# EAGLE design Automaton320 (EAGLE 9.6.2)
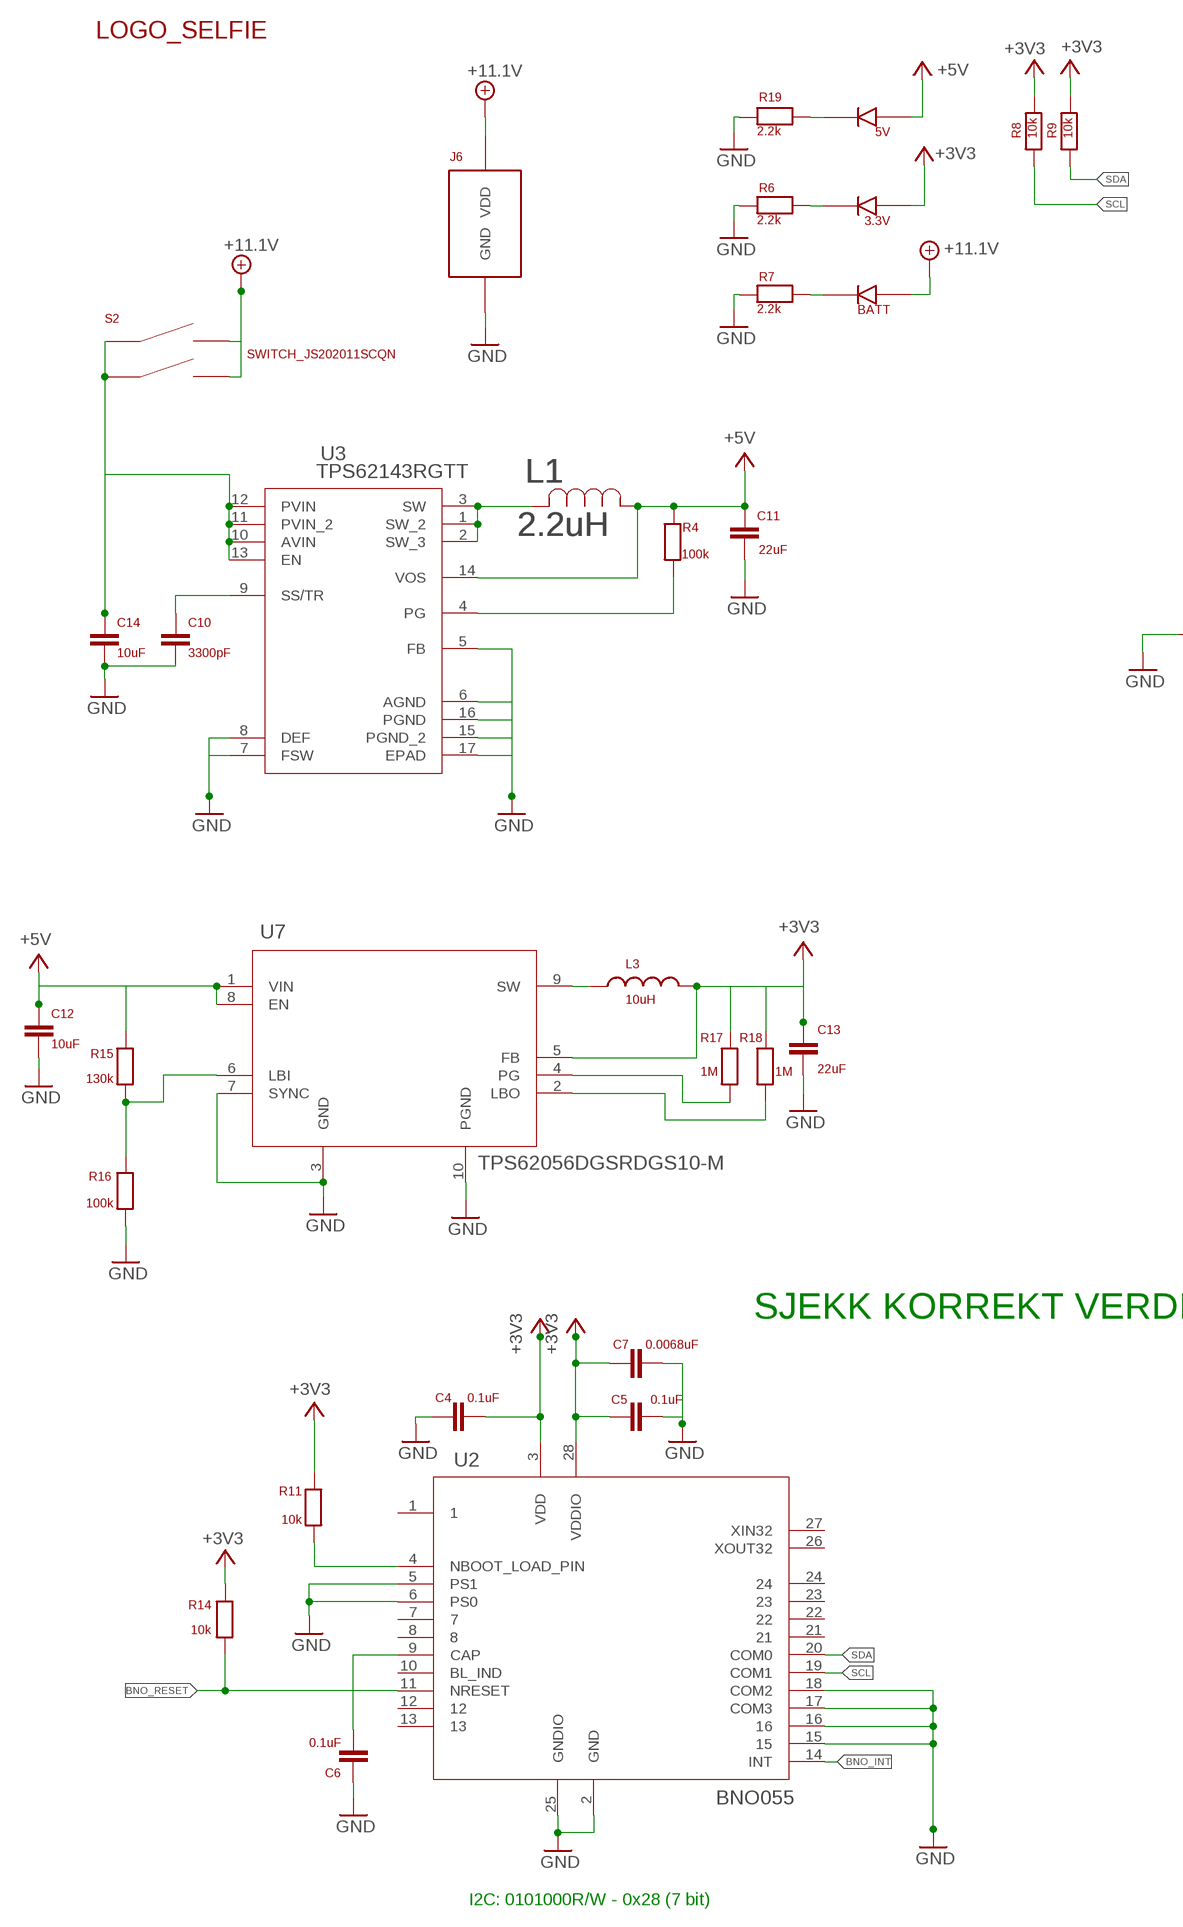
[diagram p0: schematic, sheet 1, part 1 of 2]
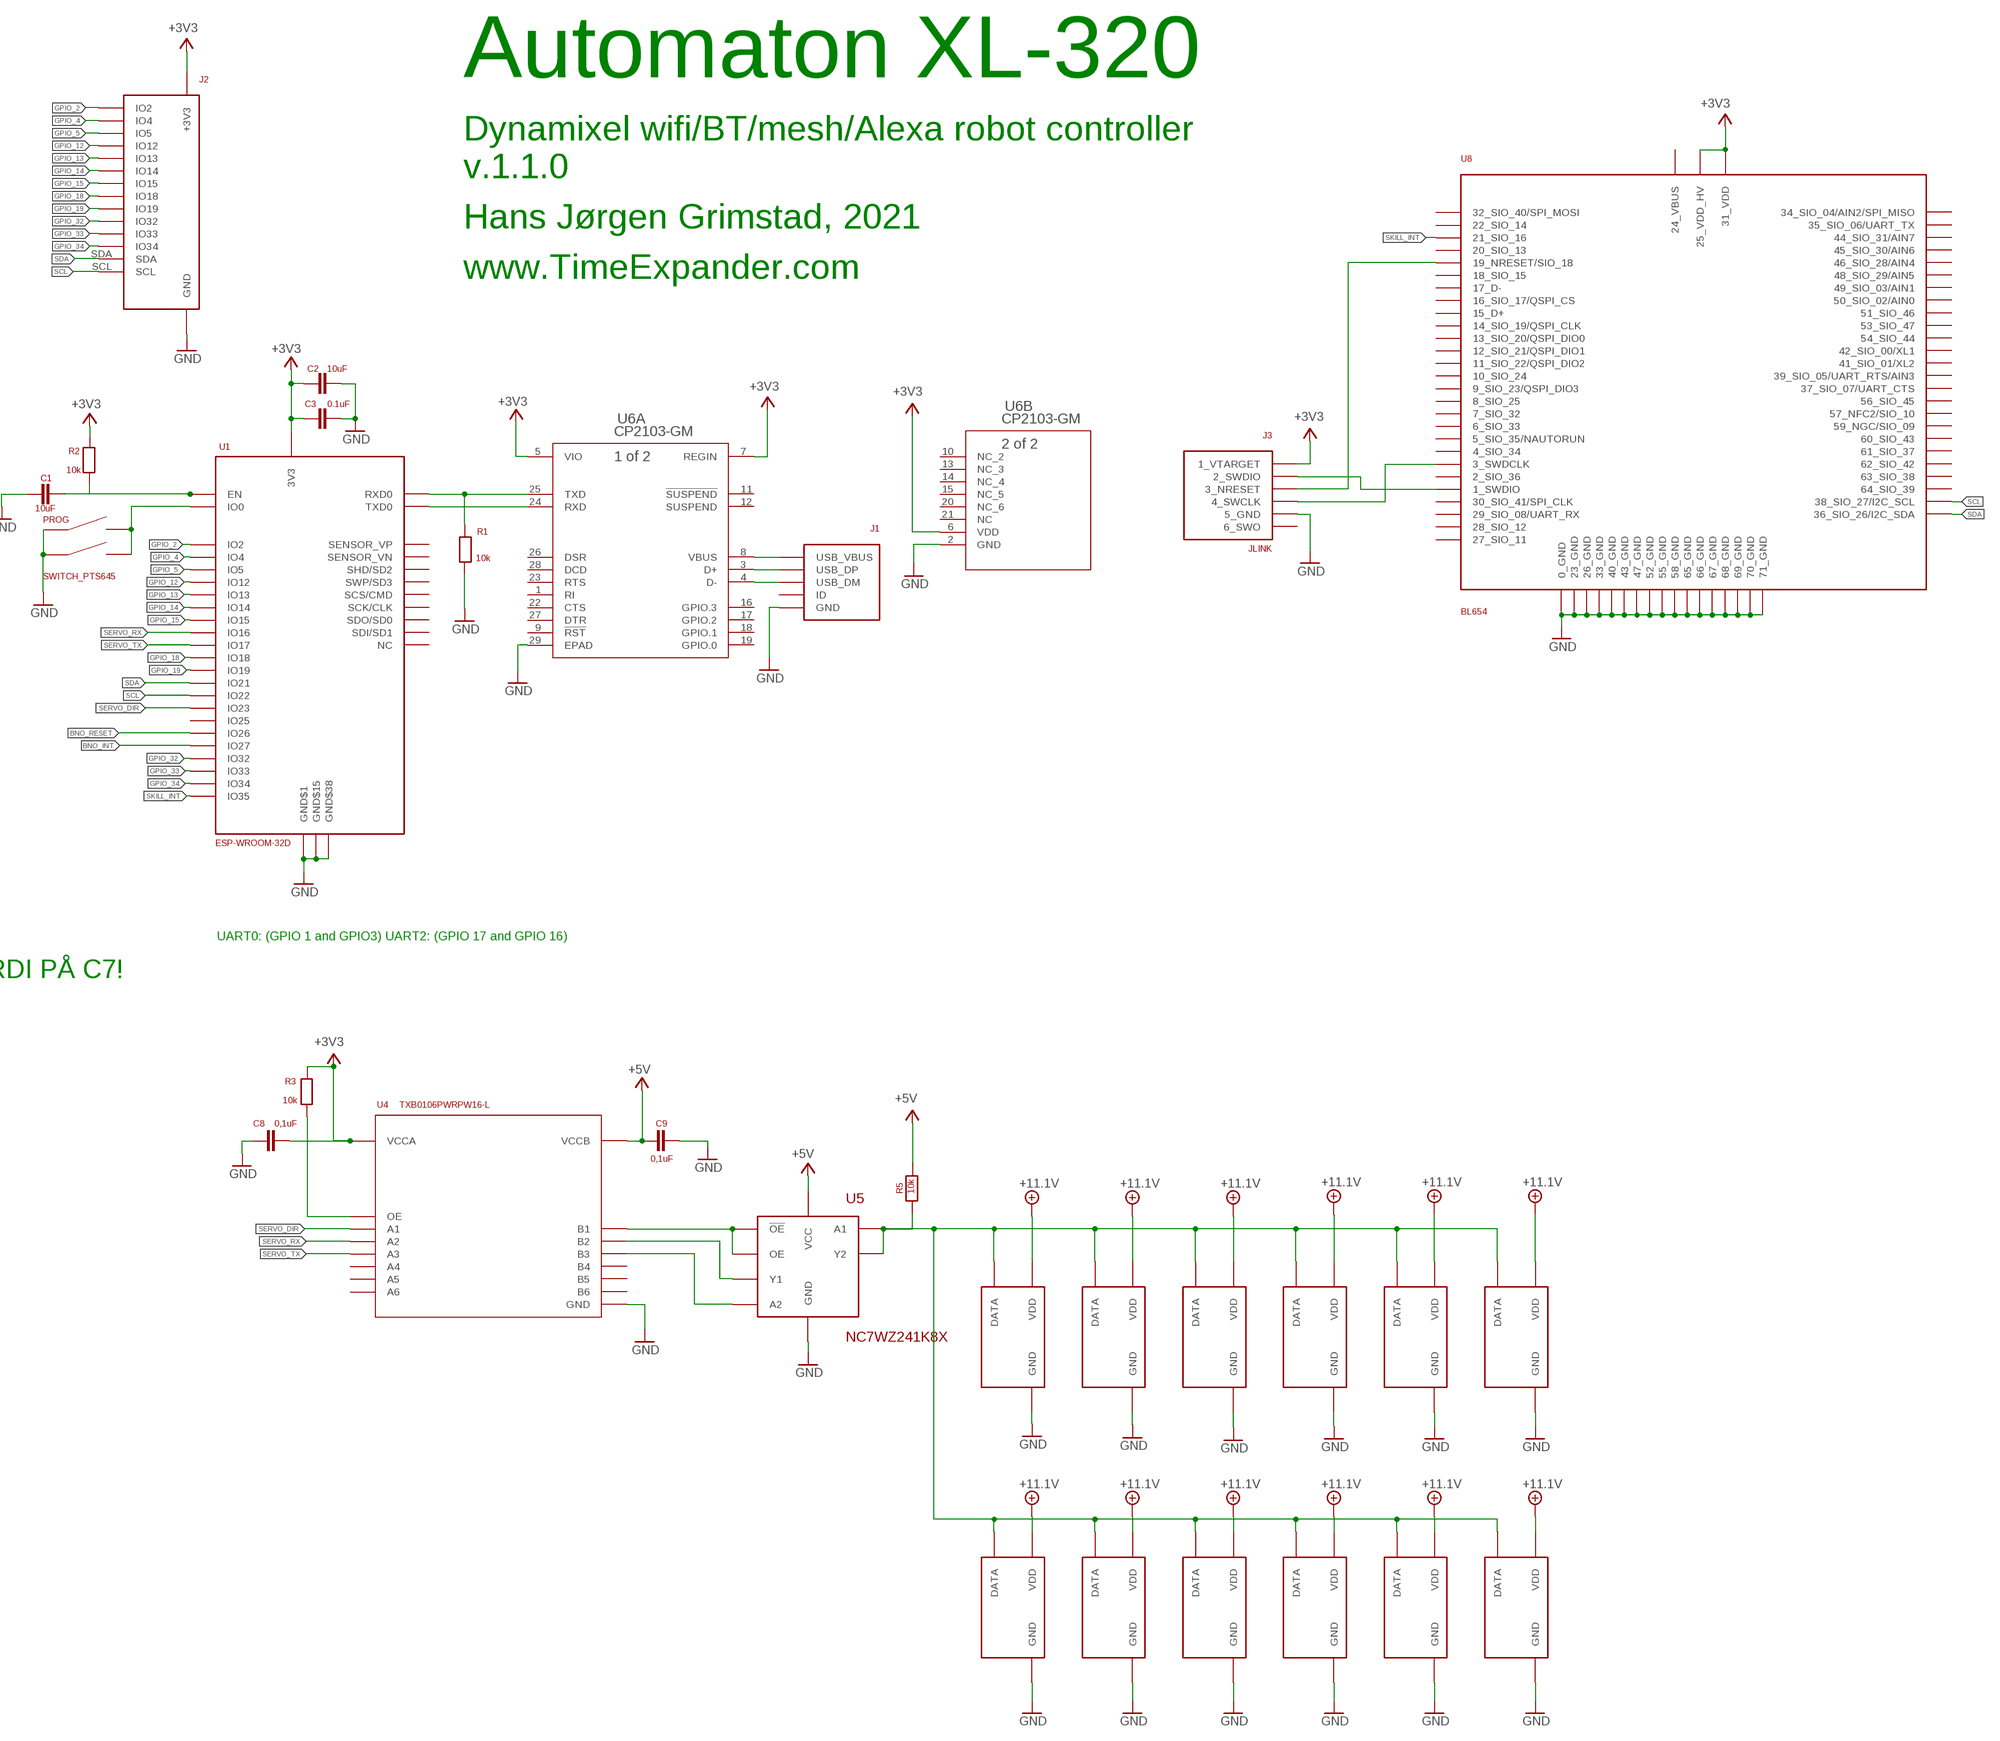
[diagram p1: schematic, sheet 1, part 2 of 2]

## Parts
3.3V  LED_APTR3216PBC/A  [LED_APTR3216PBC/A]
5V  LED_APTR3216PBC/A  [LED_APTR3216PBC/A]
BATT  LED_APTR3216PBC/A  [LED_APTR3216PBC/A]
C1  10uF  CAPACITOR0402  [CAP_0402]
C2  10uF  CAPACITOR0402  [CAP_0402]
C3  0.1uF  CAPACITOR0402  [CAP_0402]
C4  0.1uF  CAPACITOR0402  [CAP_0402]
C5  0.1uF  CAPACITOR0402  [CAP_0402]
C6  0.1uF  CAPACITOR0402  [CAP_0402]
C7  0.0068uF  CAPACITOR0402  [CAP_0402]
C8  0,1uF  CAPACITOR0402  [CAP_0402]
C9  0,1uF  CAPACITOR0402  [CAP_0402]
C10  3300pF  CAPACITOR0402  [CAP_0402]
C11  22uF  CAPACITOR1206  [CAP_1206]
C12  10uF  CAPACITOR1206  [CAP_1206]
C13  22uF  CAPACITOR1206  [CAP_1206]
C14  10uF  CAPACITOR1206  [CAP_1206]
DM1  DYNAMIXEL_MOLEX_MINISPOX_3P_HEADERAX-12  [DYNAMIXEL_MOLEX_MINISPOX_3P_HEADER]
DM2  DYNAMIXEL_MOLEX_MINISPOX_3P_HEADERAX-12  [DYNAMIXEL_MOLEX_MINISPOX_3P_HEADER]
DM3  DYNAMIXEL_MOLEX_MINISPOX_3P_HEADERAX-12  [DYNAMIXEL_MOLEX_MINISPOX_3P_HEADER]
DM4  DYNAMIXEL_MOLEX_MINISPOX_3P_HEADERAX-12  [DYNAMIXEL_MOLEX_MINISPOX_3P_HEADER]
DM5  DYNAMIXEL_MOLEX_MINISPOX_3P_HEADERAX-12  [DYNAMIXEL_MOLEX_MINISPOX_3P_HEADER]
DM6  DYNAMIXEL_MOLEX_MINISPOX_3P_HEADERAX-12  [DYNAMIXEL_MOLEX_MINISPOX_3P_HEADER]
J1  USB_RCPT_10118192-0001LF  [USB_RCPT_10118192-0001LF]
J2  ESP_ROBOT_BOARD_GPIO_16  [ESP_ROBOT_BOARD_GPIO_16]
J3  JLINK-6PIN  [JLINK-6PIN]
J6  BATTERY  POWER_SOLDER_TERMINAL9V  [BATTERY_SOLDER_TERMINAL]
L1  2.2uH  IHLP1616ABER2R2M11IND_IHLP-1616AB-M  [IND_IHLP-1616AB-M]
L3  10uH  INDUCTOR_VLCF4024T-100MR90-2  [IND_4028]
PROG  SWITCH_PTS645  [SWITCH_PTS645_EE_NBIOT_01]
R1  10k  RESISTOR  [RES_0402]
R2  10k  RESISTOR  [RES_0402]
R3  10k  RESISTOR  [RES_0402]
R4  100k  RESISTOR  [RES_0402]
R5  10k  RESISTOR  [RES_0402]
R6  2.2k  RESISTOR  [RES_0402]
R7  2.2k  RESISTOR  [RES_0402]
R8  10k  RESISTOR  [RES_0402]
R9  10k  RESISTOR  [RES_0402]
R11  10k  RESISTOR  [RES_0402]
R14  10k  RESISTOR  [RES_0402]
R15  130k  RESISTOR  [RES_0402]
R16  100k  RESISTOR  [RES_0402]
R17  1M  RESISTOR  [RES_0402]
R18  1M  RESISTOR  [RES_0402]
R19  2.2k  RESISTOR  [RES_0402]
S2  SWITCH_JS202011SCQN  [SWITCH_JS202011SCQN]
U1  ESP-WROOM-32D  [ESP_WROOM_32D]
U2  BNO055  [QFN_BNO055]
U3  TPS62143RGTT  [RGT16_1P7X1P7]
U4  TXB0106PWRPW16-L  [PW16-L]
U5  NC7WZ241K8X  [NC7WZ241K8X]
U6  CP2103-GM  CP2103-GMQFN28_5X5_SIL-M  [QFN28_5X5_SIL-M]
U7  TPS62056DGSRDGS10-M  [DGS10-M]
U8  BL654  [BL654]
U$1  DYNAMIXEL_MOLEX_MINISPOX_3P_HEADERXL-320  [DYNAMIXEL_MICROLATCH_3P_HEADER]
U$2  LOGO_SELFIESELFIE_2  [TIMEEXPANDER_LOGO_1]
U$4  DYNAMIXEL_MOLEX_MINISPOX_3P_HEADERXL-320  [DYNAMIXEL_MICROLATCH_3P_HEADER]
U$5  DYNAMIXEL_MOLEX_MINISPOX_3P_HEADERXL-320  [DYNAMIXEL_MICROLATCH_3P_HEADER]
U$6  DYNAMIXEL_MOLEX_MINISPOX_3P_HEADERXL-320  [DYNAMIXEL_MICROLATCH_3P_HEADER]
U$8  DYNAMIXEL_MOLEX_MINISPOX_3P_HEADERXL-320  [DYNAMIXEL_MICROLATCH_3P_HEADER]
U$9  DYNAMIXEL_MOLEX_MINISPOX_3P_HEADERXL-320  [DYNAMIXEL_MICROLATCH_3P_HEADER]

## Nets
+3V3: 3.3V.A C2.P$1 C3.P$1 C4.P$2 C5.P$1 C7.P$1 C8.P$2 C13.P$1 J2.+3V3 J3.1_VTARGET L3.2 R2.P$2 R3.P$2 R8.P$2 R9.P$2 R11.P$2 R14.P$2 R17.P$2 R18.P$2 U1.2(3V3) U2.3(VDD) U2.28(VDDIO) U4.2(VCCA) U6.5(A:VIO) U6.6(B:VDD) U6.7(A:REGIN) U7.5(FB) U8.25(25_VDD_HV) U8.31(31_VDD)
+5V: 5V.A C9.P$1 C11.P$1 C12.P$1 L1.1 R4.P$2 R5.P$2 R15.P$2 U3.14(VOS) U4.15(VCCB) U5.VCC U7.1(VIN) U7.8(EN)
+10V: BATT.A DM1.VDD DM2.VDD DM3.VDD DM4.VDD DM5.VDD DM6.VDD J6.+(VDD) S2.3(B2) S2.6(B1) U$1.VDD U$4.VDD U$5.VDD U$6.VDD U$8.VDD U$9.VDD ; supply symbol labelled +11.1V
BNO_INT: U1.12(IO27) U2.14(INT)
BNO_RESET: R14.P$1 U1.11(IO26) U2.11(NRESET)
GND: C1.P$1 C2.P$2 C3.P$2 C4.P$1 C5.P$2 C6.P$1 C7.P$2 C8.P$1 C9.P$2 C10.P$2 C11.P$2 C12.P$2 C13.P$2 C14.P$2 DM1.GND DM2.GND DM3.GND DM4.GND DM5.GND DM6.GND J1.GND J2.GND J3.5_GND J6.-(GND) PROG.A1 PROG.A2 R1.P$2 R6.P$1 R7.P$1 R16.P$1 R19.P$1 U1.1(GND$1) U1.15(GND$15) U1.38(GND$38) U1.GND$39(GND$38) U1.GND$40(GND$38) U1.GND$41(GND$38) U1.GND$42(GND$38) U1.GND$43(GND$38) U1.GND$44(GND$38) U1.GND$45(GND$38) U1.GND$46(GND$38) U1.GND$47(GND$38) U2.2(GND) U2.5(PS1) U2.6(PS0) U2.15 U2.16 U2.17(COM3) U2.18(COM2) U2.25(GNDIO) U3.5(FB) U3.6(AGND) U3.7(FSW) U3.8(DEF) U3.15(PGND_2) U3.16(PGND) U3.17(EPAD) U4.9(GND) U5.GND U6.2(B:GND) U6.29(A:EPAD) U7.3(GND) U7.7(SYNC) U7.10(PGND) U8.0(0_GND) U8.23(23_GND) U8.26(26_GND) U8.33(33_GND) U8.40(40_GND) U8.43(43_GND) U8.47(47_GND) U8.52(52_GND) U8.55(55_GND) U8.58(58_GND) U8.65(65_GND) U8.66(66_GND) U8.67(67_GND) U8.68(68_GND) U8.69(69_GND) U8.70(70_GND) U8.71(71_GND) U$1.GND U$4.GND U$5.GND U$6.GND U$8.GND U$9.GND
GPIO_2: J2.IO2 U1.24(IO2)
GPIO_4: J2.IO4 U1.26(IO4)
GPIO_5: J2.IO5 U1.29(IO5)
GPIO_12: J2.IO12 U1.14(IO12)
GPIO_13: J2.IO13 U1.16(IO13)
GPIO_14: J2.IO14 U1.13(IO14)
GPIO_15: J2.IO15 U1.23(IO15)
GPIO_18: J2.IO18 U1.30(IO18)
GPIO_19: J2.IO19 U1.31(IO19)
GPIO_32: J2.IO32 U1.8(IO32)
GPIO_33: J2.IO33 U1.9(IO33)
GPIO_34: J2.IO34 U1.6(IO34)
N$1: C1.P$2 R2.P$1 U1.3(EN)
N$2: 3.3V.C R6.P$2
N$3: C10.P$1 U3.9(SS/TR)
N$4: R1.P$1 U1.34(RXD0) U6.25(A:TXD)
N$5: U1.35(TXD0) U6.24(A:RXD)
N$6: PROG.B1 PROG.B2 U1.25(IO0)
N$7: L1.2 U3.1(SW_2) U3.2(SW_3) U3.3(SW)
N$8: U4.16(B1) U5.!OE U5.OE
N$9: R4.P$1 U3.4(PG)
N$10: U4.14(B2) U5.Y1
N$11: U4.13(B3) U5.A2
N$12: J3.2_SWDIO U8.1(1_SWDIO)
N$13: C14.P$1 S2.2(A2) S2.5(A1) U3.10(AVIN) U3.11(PVIN_2) U3.12(PVIN) U3.13(EN)
N$14: R3.P$1 U4.8(OE)
N$15: BATT.C R7.P$2
N$16: J1.VCC(USB_VBUS) U6.8(A:VBUS)
N$17: J1.D+(USB_DP) U6.3(A:D+)
N$18: J1.D-(USB_DM) U6.4(A:D-)
N$19: DM1.DATA DM2.DATA DM3.DATA DM4.DATA DM5.DATA DM6.DATA R5.P$1 U5.A1 U5.Y2 U$1.DATA U$4.DATA U$5.DATA U$6.DATA U$8.DATA U$9.DATA
N$20: J3.4_SWDCLK(4_SWCLK) U8.3(3_SWDCLK)
N$21: J3.3_NRESET U8.19(19_NRESET/SIO_18)
N$23: 5V.C R19.P$2
N$71: R11.P$1 U2.4(NBOOT_LOAD_PIN)
N$72: C6.P$2 U2.9(CAP)
N$77: R15.P$1 R16.P$2 U7.6(LBI)
N$78: L3.1 U7.9(SW)
N$80: R17.P$1 U7.4(PG)
N$81: R18.P$1 U7.2(LBO)
SCL: J2.SCL R8.P$1 U1.36(IO22) U2.19(COM1) U8.38(38_SIO_27/I2C_SCL)
SDA: J2.SDA R9.P$1 U1.33(IO21) U2.20(COM0) U8.36(36_SIO_26/I2C_SDA)
SERVO_DIR: U1.37(IO23) U4.1(A1)
SERVO_RX: U1.27(IO16) U4.3(A2)
SERVO_TX: U1.28(IO17) U4.4(A3)
SKILL_INT: U1.7(IO35) U8.21(21_SIO_16)
Unconnected: J1.ID J3.6_SWO U1.4(SENSOR_VP) U1.5(SENSOR_VN) U1.10(IO25) U1.17(SHD/SD2) U1.18(SWP/SD3) U1.19(SCS/CMD) U1.20(SCK/CLK) U1.21(SDO/SD0) U1.22(SDI/SD1) U1.32(NC) U2.1 U2.7 U2.8 U2.10(BL_IND) U2.12 U2.13 U2.21 U2.22 U2.23 U2.24 U2.26(XOUT32) U2.27(XIN32) U4.5(A4) U4.6(A5) U4.7(A6) U4.10(B6) U4.11(B5) U4.12(B4) U6.1(A:RI) U6.9(A:!RST) U6.10(B:NC_2) U6.11(A:!SUSPEND) U6.12(A:SUSPEND) U6.13(B:NC_3) U6.14(B:NC_4) U6.15(B:NC_5) U6.16(A:GPIO.3) U6.17(A:GPIO.2) U6.18(A:GPIO.1) U6.19(A:GPIO.0) U6.20(B:NC_6) U6.21(B:NC) U6.22(A:CTS) U6.23(A:RTS) U6.26(A:DSR) U6.27(A:DTR) U6.28(A:DCD) U8.2(2_SIO_36) U8.4(4_SIO_34) U8.5(5_SIO_35/NAUTORUN) U8.6(6_SIO_33) U8.7(7_SIO_32) U8.8(8_SIO_25) U8.9(9_SIO_23/QSPI_DIO3) U8.10(10_SIO_24) U8.11(11_SIO_22/QSPI_DIO2) U8.12(12_SIO_21/QSPI_DIO1) U8.13(13_SIO_20/QSPI_DIO0) U8.14(14_SIO_19/QSPI_CLK) U8.15(15_D+) U8.16(16_SIO_17/QSPI_CS) U8.17(17_D-) U8.18(18_SIO_15) U8.20(20_SIO_13) U8.22(22_SIO_14) U8.24(24_VBUS) U8.27(27_SIO_11) U8.28(28_SIO_12) U8.29(29_SIO_08/UART_RX) U8.30(30_SIO_41/SPI_CLK) U8.32(32_SIO_40/SPI_MOSI) U8.34(34_SIO_04/AIN2/SPI_MISO) U8.35(35_SIO_06/UART_TX) U8.37(37_SIO_07/UART_CTS) U8.39(39_SIO_05/UART_RTS/AIN3) U8.41(41_SIO_01/XL2) U8.42(42_SIO_00/XL1) U8.44(44_SIO_31/AIN7) U8.45(45_SIO_30/AIN6) U8.46(46_SIO_28/AIN4) U8.48(48_SIO_29/AIN5) U8.49(49_SIO_03/AIN1) U8.50(50_SIO_02/AIN0) U8.51(51_SIO_46) U8.53(53_SIO_47) U8.54(54_SIO_44) U8.56(56_SIO_45) U8.57(57_NFC2/SIO_10) U8.59(59_NGC/SIO_09) U8.60(60_SIO_43) U8.61(61_SIO_37) U8.62(62_SIO_42) U8.63(63_SIO_38) U8.64(64_SIO_39)

## Notes on the sheet
- Automaton XL-320
- Dynamixel wifi/BT/mesh/Alexa robot controller
- v.1.1.0
- Hans Jørgen Grimstad, 2021
- www.TimeExpander.com
- UART0: (GPIO 1 and GPIO3) UART2: (GPIO 17 and GPIO 16)
- SJEKK KORREKT VERDI PÅ C7!
- I2C: 0101000R/W - 0x28 (7 bit)

## Library data of the parts
3.3V 5V BATT = TimeExpander2:LED_APTR3216PBC/A
C1-C14 = TimeExpander2:CAPACITOR
DM1-DM6 U$1 U$4-U$6 U$8 U$9 = TimeExpander2:DYNAMIXEL_MOLEX_MINISPOX_3P_HEADER
J1 = TimeExpander2:USB_RCPT_10118192-0001LF
J2 = TimeExpander2:ESP_ROBOT_BOARD_GPIO_16
J3 = TimeExpander2:JLINK-6PIN
J6 = TimeExpander2:POWER_SOLDER_TERMINAL
L1 = TimeExpander2:IHLP1616ABER2R2M11; BUILT_BY: EMA_UL_Team; MANUFACTURER_PART_NUMBER: IHLP1616ABER2R2M11; VENDOR: VISHAY
L3 = TimeExpander2:INDUCTOR_VLCF4024T-100MR90-2
PROG = TimeExpander2:SWITCH_PTS645
R1-R9 R11 R14-R19 = TimeExpander2:RESISTOR
S2 = TimeExpander2:SWITCH_JS202011SCQN
U1 = TimeExpander2:ESP-WROOM-32D
U2 = TimeExpander2:BNO055; BUILT_BY: EMA_Matt; COPYRIGHT: Copyright (C) 2018 Accelerated Designs. All rights reserved; MANUFACTURER_PART_NUMBER: BNO055; VENDOR: Bosch
U3 = TimeExpander2:TPS62143RGTT; BUILT_BY: EMA_UL_Team; MANUFACTURER: Texas Instruments; MANUFACTURER_PART_NUMBER: TPS62143RGTT; VENDOR: Texas Instruments
U4 = TimeExpander2:TXB0106PWR; MANUFACTURER_PART_NUMBER: TXB0106PWR; VENDOR: Texas Instruments
U5 = TimeExpander2:NC7WZ241K8X
U6 = TimeExpander2:CP2103-GM; BUILT_BY: EMA_UL_Team; MANUFACTURER_PART_NUMBER: CP2103-GM; SOURCELIBRARY: Silicon_Labs_2015-03-23; VENDOR: Silicon Labs
U7 = TimeExpander2:TPS62056DGSR; BUILT_BY: EMA_UL_Team; MANUFACTURER: Texas Instruments; MANUFACTURER_PART_NUMBER: TPS62056DGSR; VENDOR: Texas Instruments
U8 = TimeExpander2:BL654
U$2 = TimeExpander2:LOGO_SELFIE

## Board
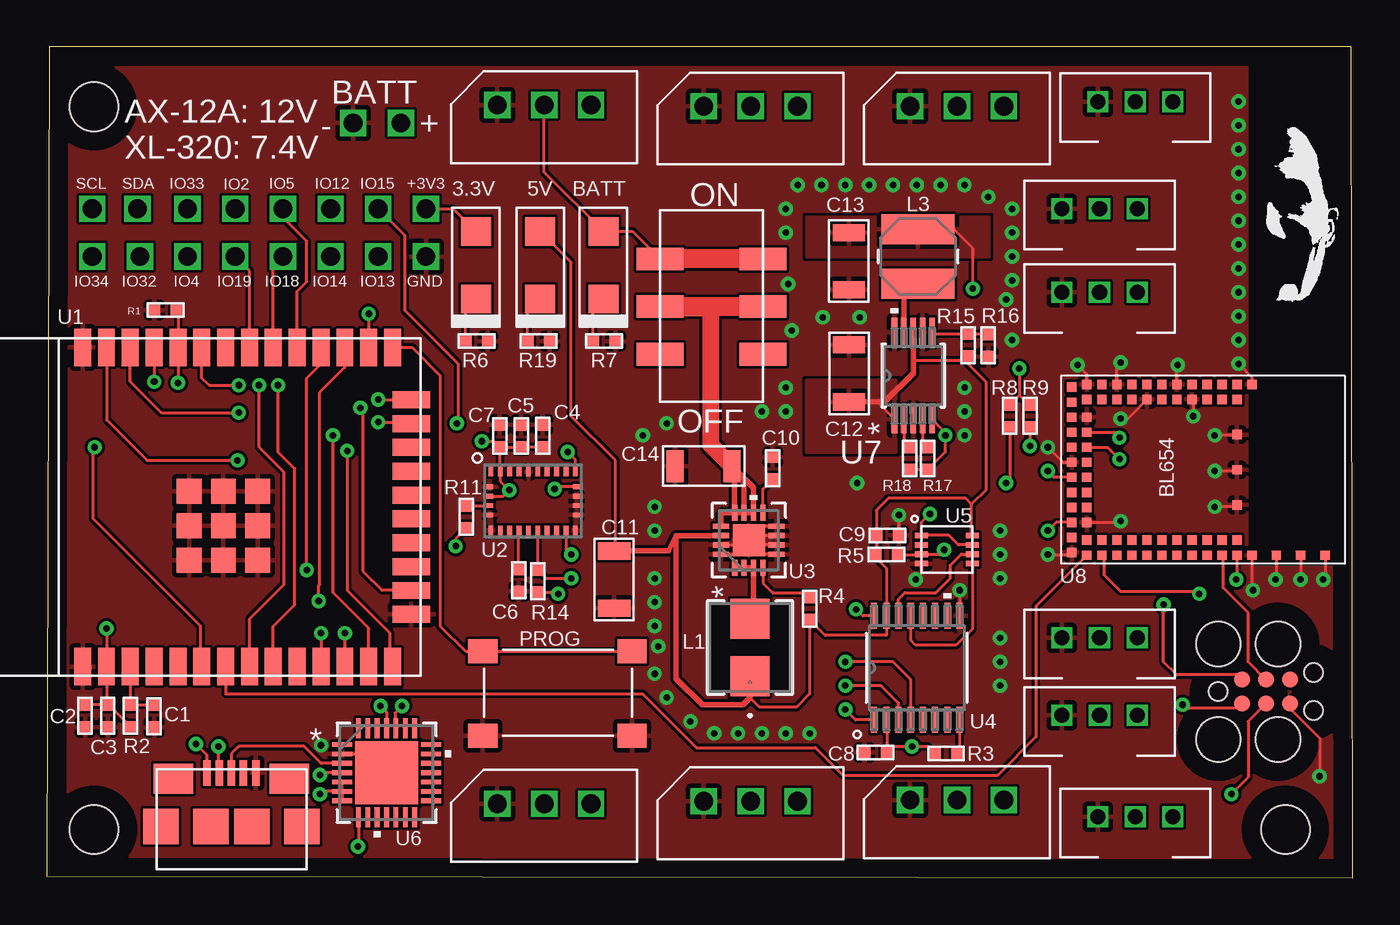
[diagram p2: board, top side]
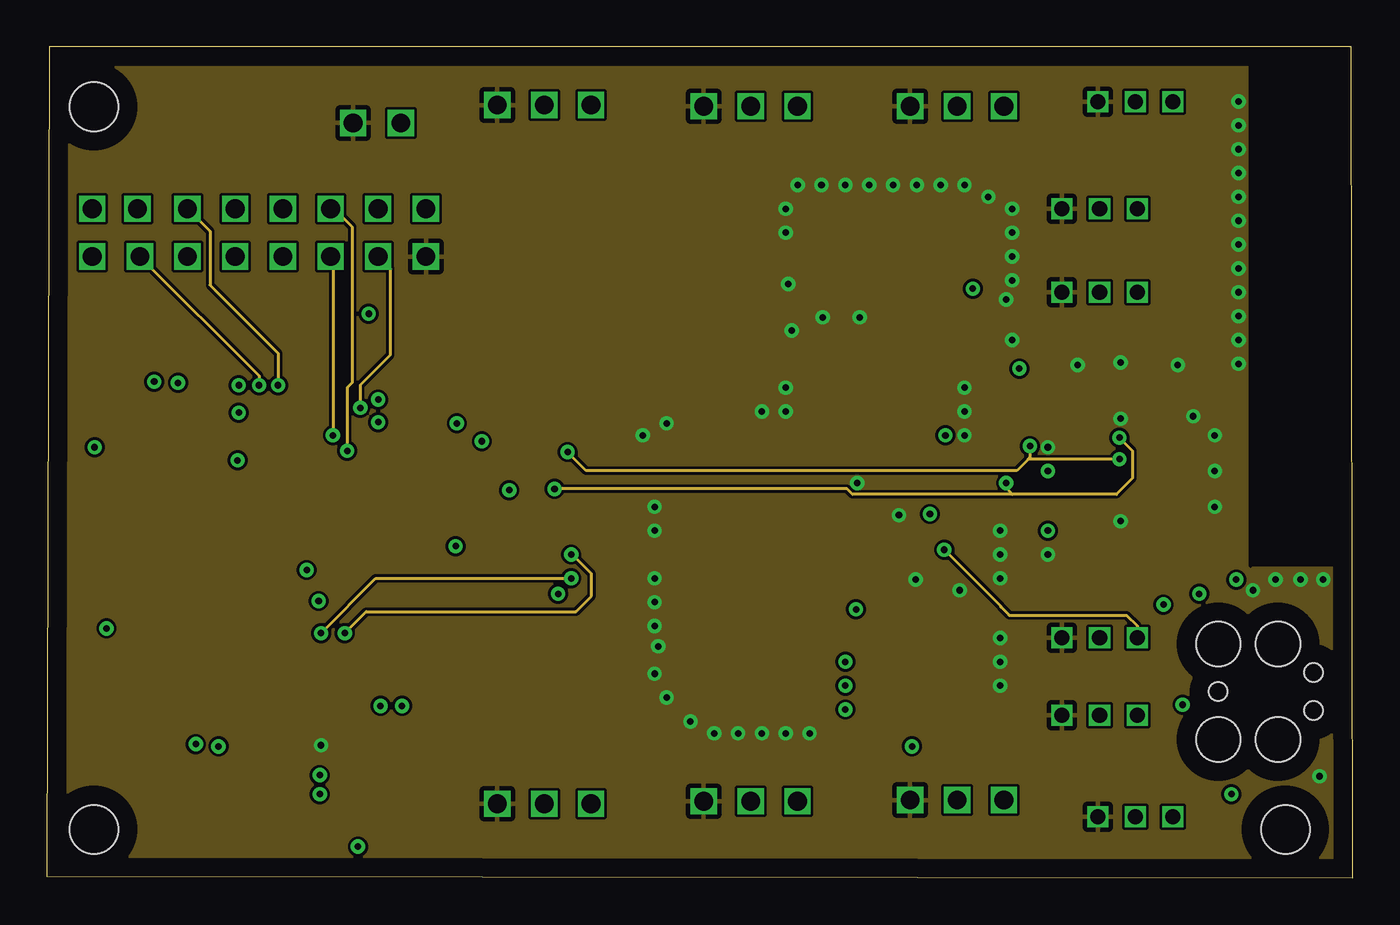
[diagram p3: board, inner layer GND]
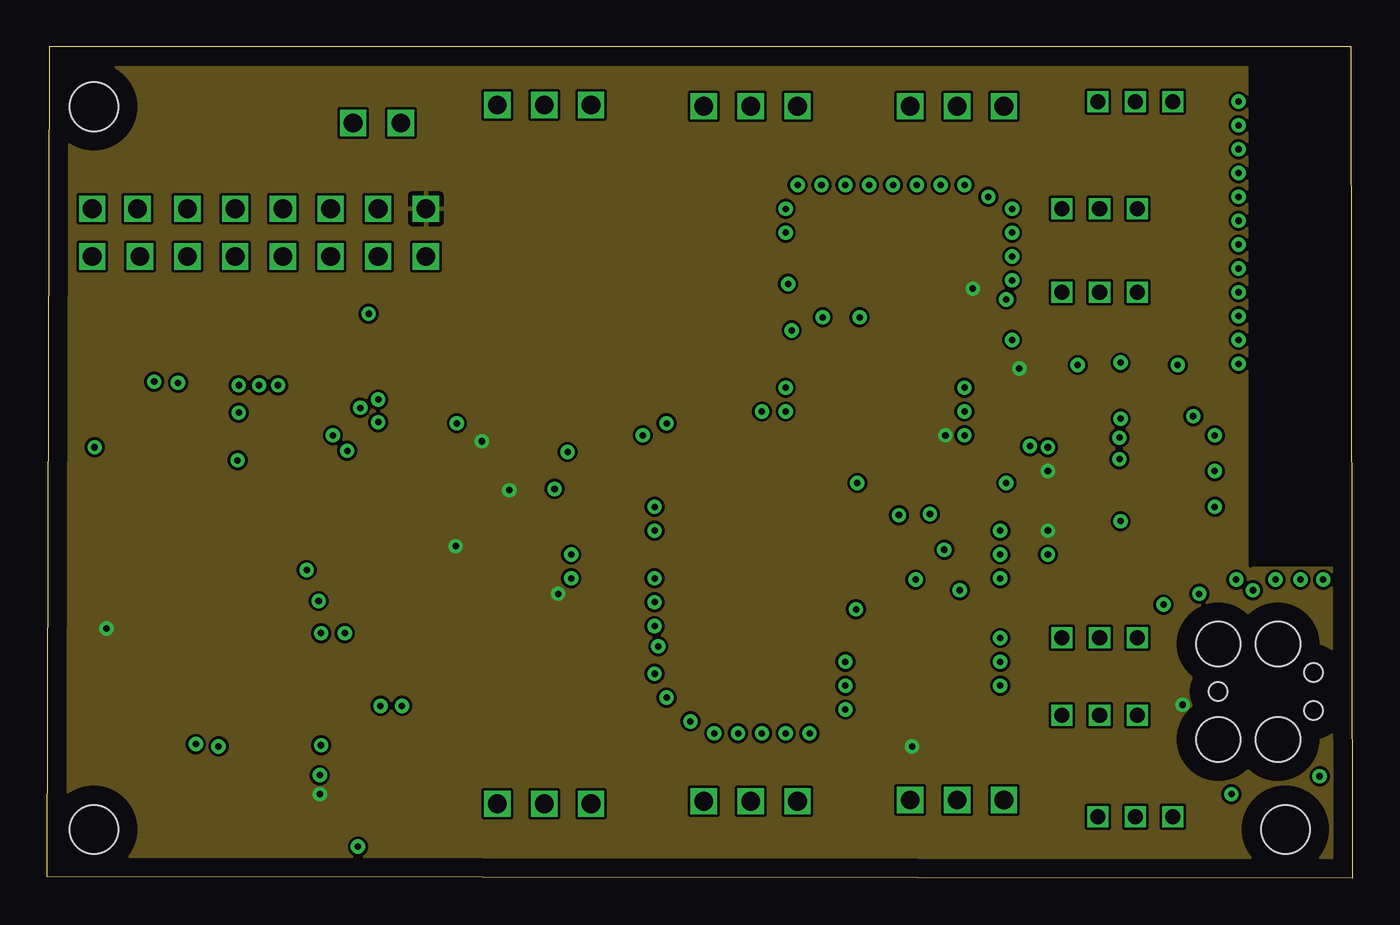
[diagram p4: board, inner layer +3V3]
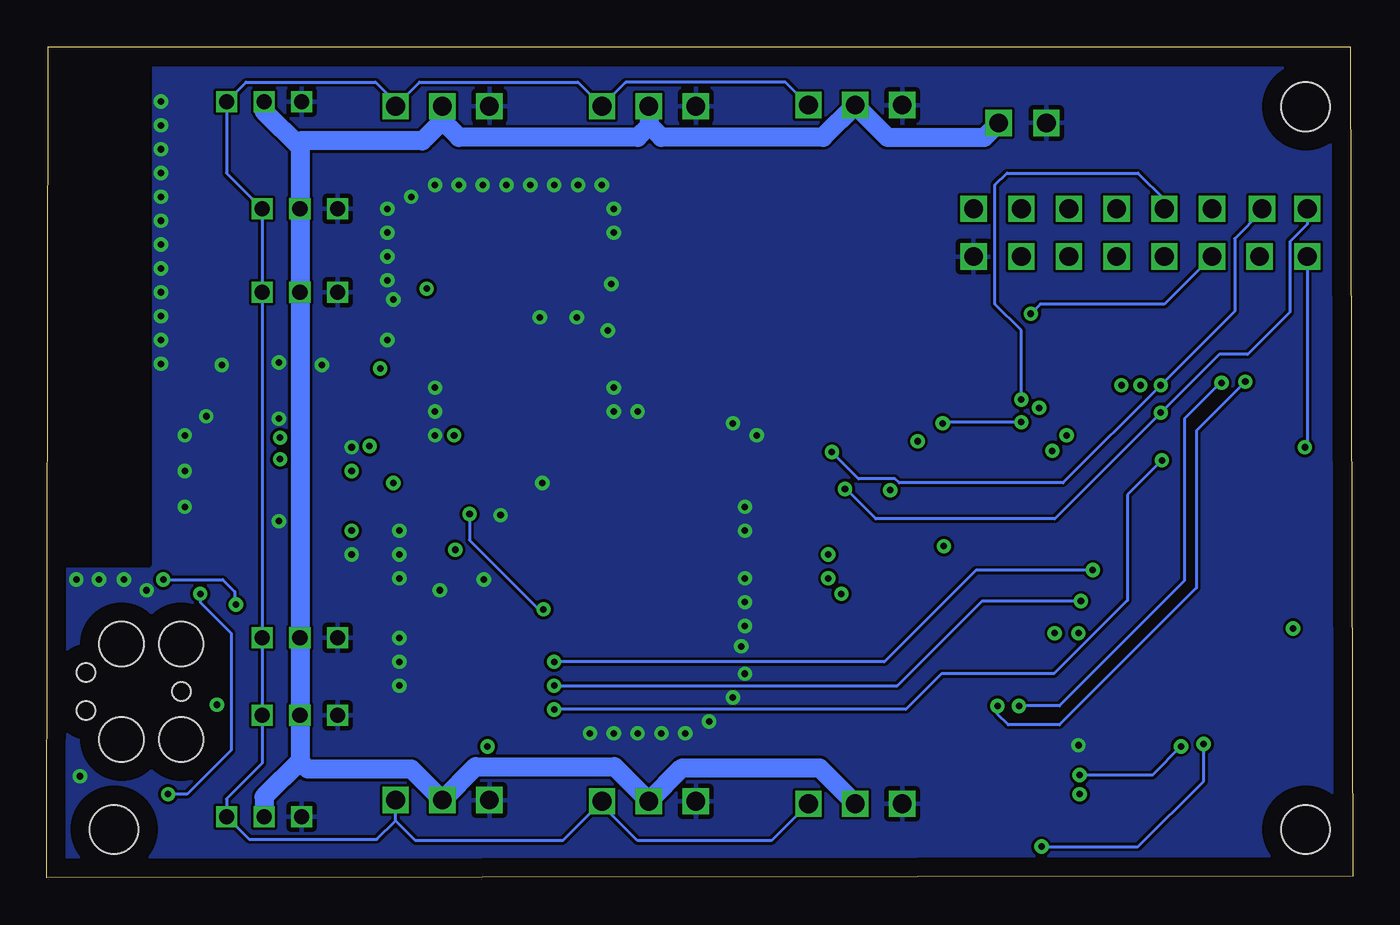
[diagram p5: board, bottom side, seen from below]

Size 69.58 x 44.25 mm. Coordinates in mm from the lower left corner, seen from the top.
Outline: 0,0.06 69.58,0 69.51,44.25 0.13,44.25 0,0.06
Copper layers (1+2*15+16): Top 0.035mm / dielectric 1.5mm / GND 0.035mm / dielectric 0.15mm / +3V3 0.035mm / dielectric 0.2mm / Bottom 0.035mm
Design rules "default *": minimum track width 6mil, minimum drill 0.35mm, track to track 6mil, track to pad 6mil, pad to pad 6mil, via to via 6mil, smd to smd 6mil, copper to edge 40mil, drill to drill 6mil, minimum pad ring 5mil, minimum via ring 8mil, stop-mask expansion 4mil, vias tented up to drill 15mil, thermal gap 10mil
Holes 2.6 mm at 2.5,41.06 66,2.56 2.5,2.56

### Footprints (pad centres in the part's own frame; a part is rotated, then mirrored left to right if it is on the bottom)
LED_APTR3216PBC/A = smd 1.5 x 1.6: A 0,0; C 3.6,0
CAP_0402 = smd 0.635 x 0.61: P$1 0,0; P$2 1.194,0
CAP_1206 = smd 0.914 x 1.72: P$1 0,0; P$2 3.048,0
DYNAMIXEL_MOLEX_MINISPOX_3P_HEADER = drill 1 square: DATA 5,0; GND 0,0; VDD 2.5,0
USB_RCPT_10118192-0001LF = smd 0.4 x 1.35: D+ 3.1,0.3; D- 2.45,0.3; GND 4.4,0.3; ID 3.75,0.3; VCC 1.8,0.3 | smd 2.1 x 1.6: P$1 0,0; P$2 6.2,0 | smd 1.9 x 1.9: P$8 -0.65,-2.55; P$9 6.85,-2.55; P$10 2,-2.55; P$11 4.2,-2.55
ESP_ROBOT_BOARD_GPIO_16 = drill 1 square: +3V3 2.54,-15.24; GND 0,-15.24; IO2 2.54,-5.08; IO4 0,-2.54; IO5 2.54,-7.62; IO12 2.54,-10.16; IO13 0,-12.7; IO14 0,-10.16; IO15 2.54,-12.7; IO18 0,-7.62; IO19 0,-5.08; IO32 0,0; IO33 2.54,-2.54; IO34 0,2.54; SCL 2.54,2.54; SDA 2.54,0.127
JLINK-6PIN = smd 0.863 x 0.863: 1_VTARGET 1.27,-0.635; 2_SWDIO 1.27,0.635; 3_NRESET 2.54,-0.635; 4_SWDCLK 2.54,0.635; 5_GND 3.81,-0.635; 6_SWO 3.81,0.635 | hole 0.991: 0,0; 5.08,1.016; 5.08,-1.016 | hole 2.375: 0,2.54; 3.175,2.54; 0,-2.54; 3.175,-2.54
BATTERY_SOLDER_TERMINAL = drill 1 square: + 0,0; - 2.54,0
IND_IHLP-1616AB-M = smd 2.142 x 2.103: 1 -1.528,0; 2 1.528,0
IND_4028 = smd 1.6 x 3.9: 1 -1.45,0; 2 1.45,0
SWITCH_PTS645_EE_NBIOT_01 = smd 1.55 x 1.3: A1 0,0; A2 7.95,0; B1 0,-4.5; B2 7.95,-4.5
RES_0402 = smd 0.635 x 0.61: P$1 0,0; P$2 1.194,0
SWITCH_JS202011SCQN = smd 2.5 x 1.2: 1 0,0; 2 0,-2.54; 3 0,-5.08; 4 5.5,0; 5 5.5,-2.54; 6 5.5,-5.08
ESP_WROOM_32D = smd 2 x 0.9: 1 0,16.51; 2 0,15.24; 3 0,13.97; 4 0,12.7; 5 0,11.43; 6 0,10.16; 7 0,8.89; 8 0,7.62; 9 0,6.35; 10 0,5.08; 11 0,3.81; 12 0,2.54; 13 0,1.27; 14 0,0; 25 17,0; 26 17,1.27; 27 17,2.54; 28 17,3.81; 29 17,5.08; 30 17,6.35; 31 17,7.62; 32 17,8.89; 33 17,10.16; 34 17,11.43; 35 17,12.7; 36 17,13.97; 37 17,15.24; 38 17,16.51 | smd 0.9 x 2: 15 2.785,-1; 16 4.055,-1; 17 5.325,-1; 18 6.595,-1; 19 7.865,-1; 20 9.135,-1; 21 10.405,-1; 22 11.675,-1; 23 12.945,-1; 24 14.215,-1 | smd 1.33 x 1.33: GND$39 5.665,10.845; GND$40 7.5,10.845; GND$41 9.335,10.845; GND$42 5.665,9.01; GND$43 7.5,9.01; GND$44 9.335,9.01; GND$45 5.665,7.175; GND$46 7.5,7.175; GND$47 9.335,7.175
QFN_BNO055 = smd 0.254 x 0.483: 1 -2.25,1.562; 6 -2.25,-1.562; 7 -1.75,-1.562; 8 -1.25,-1.562; 9 -0.75,-1.562; 10 -0.25,-1.562; 11 0.25,-1.562; 12 0.75,-1.562; 13 1.25,-1.562; 14 1.75,-1.562; 15 2.25,-1.562; 20 2.25,1.562; 21 1.75,1.562; 22 1.25,1.562; 23 0.75,1.562; 24 0.25,1.562; 25 -0.25,1.562; 26 -0.75,1.562; 27 -1.25,1.562; 28 -1.75,1.562 | smd 0.381 x 0.254: 2 -2.313,0.75; 3 -2.313,0.25; 4 -2.313,-0.25; 5 -2.313,-0.75; 16 2.313,-0.75; 17 2.313,-0.25; 18 2.313,0.25; 19 2.313,0.75
RGT16_1P7X1P7 = smd 0.85 x 0.28: 1 -1.475,0.75; 2 -1.475,0.25; 3 -1.475,-0.25; 4 -1.475,-0.75; 9 1.475,-0.75; 10 1.475,-0.25; 11 1.475,0.25; 12 1.475,0.75 | smd 0.28 x 0.85: 5 -0.75,-1.475; 6 -0.25,-1.475; 7 0.25,-1.475; 8 0.75,-1.475; 13 0.75,1.475; 14 0.25,1.475; 15 -0.25,1.475; 16 -0.75,1.475 | smd 1.7 x 1.7: 17 0,0
PW16-L = smd 1.365 x 0.325: 1 -2.769,2.275; 2 -2.769,1.625; 3 -2.769,0.975; 4 -2.769,0.325; 5 -2.769,-0.325; 6 -2.769,-0.975; 7 -2.769,-1.625; 8 -2.769,-2.275; 9 2.769,-2.275; 10 2.769,-1.625; 11 2.769,-0.975; 12 2.769,-0.325; 13 2.769,0.325; 14 2.769,0.975; 15 2.769,1.625; 16 2.769,2.275
NC7WZ241K8X = smd 0.7 x 0.3: !OE 0,0; A1 0,-0.5; A2 2.7,-1.5; GND 0,-1.5; OE 2.7,-0.5; VCC 2.7,0; Y1 2.7,-1; Y2 0,-1
QFN28_5X5_SIL-M = smd 1.06 x 0.255: 1 -2.372,1.5; 2 -2.372,1; 3 -2.372,0.5; 4 -2.372,0; 5 -2.372,-0.5; 6 -2.372,-1; 7 -2.372,-1.5; 15 2.372,-1.5; 16 2.372,-1; 17 2.372,-0.5; 18 2.372,0; 19 2.372,0.5; 20 2.372,1; 21 2.372,1.5 | smd 0.255 x 1.06: 8 -1.5,-2.372; 9 -1,-2.372; 10 -0.5,-2.372; 11 0,-2.372; 12 0.5,-2.372; 13 1,-2.372; 14 1.5,-2.372; 22 1.5,2.372; 23 1,2.372; 24 0.5,2.372; 25 0,2.372; 26 -0.5,2.372; 27 -1,2.372; 28 -1.5,2.372 | smd 3.353 x 3.353: 29 0,0
DGS10-M = smd 1.528 x 0.299: 1 -2.313,1; 2 -2.313,0.5; 3 -2.313,0; 4 -2.313,-0.5; 5 -2.313,-1; 6 2.313,-1; 7 2.313,-0.5; 8 2.313,0; 9 2.313,0.5; 10 2.313,1
BL654 = smd 0.5 x 0.5: 0 4.1,2.3; 1 4.1,1.5; 2 3.3,1.5; 3 4.1,0.7; 4 3.3,0.7; 5 4.1,-0.1; 6 3.3,-0.1; 7 4.1,-0.9; 8 3.3,-0.9; 9 4.1,-1.7; 10 3.3,-1.7; 11 4.1,-2.5; 12 3.3,-2.5; 13 4.1,-3.3; 14 3.3,-3.3; 15 4.1,-4.1; 16 3.3,-4.1; 17 4.1,-4.9; 18 3.3,-4.9; 19 4.1,-5.7; 20 3.3,-5.7; 21 4.1,-6.5; 22 3.3,-6.5; 23 3.95,-7.3; 24 3.15,-7.3; 25 2.35,-7.3; 26 2.35,-6.5; 27 1.55,-7.3; 28 1.55,-6.5; 29 0.75,-7.3; 30 0.75,-6.5; 31 -0.05,-7.3; 32 -0.05,-6.5; 33 -0.85,-7.3; 34 -0.85,-6.5; 35 -1.65,-7.3; 36 -1.65,-6.5; 37 -2.45,-7.3; 38 -2.45,-6.5; 39 -3.25,-7.3; 40 -3.25,-6.5; 41 -4.05,-7.3; 42 -4.85,-7.3; 43 -5,-6.5; 44 -4.2,-6.5; 45 -5,-5.7; 46 -4.2,-5.7; 47 -5,-4.9; 48 -4.2,-4.9; 49 -5,-4.1; 50 -4.2,-4.1; 51 -5,-3.3; 52 -4.2,-3.3; 53 -5,-2.5; 54 -4.2,-2.5; 55 -5,-1.7; 56 -4.2,-1.7; 57 -5,-0.9; 58 -4.2,-0.9; 59 -5,-0.1; 60 -4.2,-0.1; 61 -5,0.7; 62 -4.2,0.7; 63 -5,1.5; 64 -4.2,1.5; 65 -5,2.3; 66 4.1,3.6; 67 4.1,4.9; 68 4.1,6.2; 69 1.425,1.5; 70 -0.45,1.5; 71 -2.325,1.5
DYNAMIXEL_MICROLATCH_3P_HEADER = drill 0.8 square: DATA 4,0; GND 0,0; VDD 2,0

### Placement (x,y rotation side)
3.3V  22.86,34.42 270 top
5V  26.29,34.42 270 top
BATT  29.65,34.42 270 top
C1  5.71,8 90 top
C2  2.03,9.21 270 top
C3  3.24,9.21 270 top
C4  26.42,24.13 270 top
C5  25.27,22.92 90 top
C6  25.15,15.24 90 top
C7  24.13,22.92 90 top
C8  43.56,6.67 0 top
C9  44.2,18.22 0 top
C10  38.67,21.21 90 top
C11  30.23,17.4 270 top
C12  42.74,25.34 90 top
C13  42.74,34.35 270 top
C14  36.51,21.91 180 top
DM1  24,3.94 0 top
DM2  24,41.15 0 top
DM3  35,41.08 0 top
DM4  46,41.08 0 top
DM5  46,4.13 0 top
DM6  35,4.06 0 top
J1  6.73,5.27 0 top
J2  4.95,33.08 90 top
J3  62.42,9.91 0 top
J6  18.86,40.2 180 top
L1  37.47,12.26 90 top
L3  46.42,33.08 90 top
PROG  31.18,7.56 180 top
R1  6.92,30.23 180 top
R2  4.45,9.21 270 top
R3  48.51,6.6 180 top
R4  40.64,14.92 270 top
R5  45.34,17.21 180 top
R6  23.5,28.58 180 top
R7  30.29,28.58 180 top
R8  51.31,24 90 top
R9  52.39,24 90 top
R11  22.35,19.81 270 top
R14  26.16,16.38 270 top
R15  49.09,28.96 270 top
R16  50.16,27.75 90 top
R17  46.93,22.92 270 top
R18  45.97,22.92 270 top
R19  26.8,28.58 180 top
S2  38.16,27.88 180 top
U1  18.41,11.24 90 top
U2  25.91,20.07 0 top
U3  37.4,17.97 90 top
U4  46.35,11.18 90 top
U5  46.61,18.22 0 top
U6  18.1,5.59 0 top
U7  46.16,26.73 90 top
U8  61.91,21.27 270 top
U$1  56,41.34 0 top
U$2  63.12,30.54 0 top
U$4  54.09,35.62 0 top
U$5  54.09,31.18 0 top
U$6  54.09,12.76 0 top
U$8  54.09,8.64 0 top
U$9  56,3.24 0 top

### Tracks (layer width: path | path; a pad name or v marks a point on that pad's centre or on a via)
+3V3  (via drill 0.35)
  Top 0.152: v3.17,13.27 U1.2 3.17,9.27 C3.P$1 | C3.P$1 C2.P$1 | C3.P$1 3.3,9.21 4.45,8.06 R2.P$2 | R14.P$2 27.17,15.19 v27.24,15.11 | R11.P$2 21.78,18.05 v21.78,17.65 | J2.+3V3 21.65,35.62 3.3V.A | v49.34,31.37 49.34,33.52 48.32,34.53 L3.2 | U7.5 47.88,23.71 v47.88,23.56 47.88,22.68 R17.P$2 R18.P$2 | U4.2 44.76,8.38 C8.P$2 45.07,6.98 v46.1,6.98 46.94,6.98 R3.P$2 | U2.3 24.32,20.32 v24.64,20.64 24.16,21.12 U2.28 24.16,22.9 24.19,22.92 C5.P$1 25.29,22.94 C4.P$2 | U8.25 53.78,18.92 v53.34,18.48 | U8.31 53.67,21.32 v53.34,21.65 | J3.1_VTARGET 63.44,9.02 60.71,9.02 v60.52,9.21 | U6.6 14.68,4.59 v14.54,4.44 | U6.6 U6.5 | U6.6 U6.7 | v51.82,27.11 51.82,25.71 | 51.82,25.71 R8.P$2 | R9.P$2 52.32,25.2 51.82,25.71 | v23.18,23.24 23.81,23.24 C7.P$1
  pour +3V3: 0,0.06 0,43.62 69.41,43.62 69.41,0.06
  pour Top: 40.47,33.08 50.23,33.08 50.23,35.18 40.47,35.18
+5V
  Top 0.152: 5V.A 27.94,32.77 27.94,24.57 30.29,22.22 30.29,17.54 C11.P$1 | 37.47,9.59 37.97,9.08 39.94,9.08 40.64,9.78 R4.P$2 41.47,12.9 44.73,12.9 U4.15 44.73,16.48 44.15,17.07 R5.P$2 44.2,17.26 C9.P$1 44.2,19.56 44.83,20.19 48.96,20.19 49.28,19.88 | U7.1 44.25,25.34 C12.P$1 | R15.P$2 48.88,27.56 | 46.16,27.56 48.88,27.56 | U5.VCC 49.28,18.26 49.28,19.88 | 48.88,27.56 50.04,26.4 50.04,20.64 49.28,19.88
  Top 0.3: 33.53,18.22 33.11,17.4 C11.P$1 | 33.53,18.22 U3.14 | L1.1 37.47,9.59 37.08,9.21 34.92,9.21 33.53,10.6 33.53,18.22 | U7.8 46.16,27.56 46.16,26.86 44.64,25.34 C12.P$1
  pour Top: 40.45,22.67 45.28,22.67 45.28,26.48 40.45,26.48
+10V
  Top 0.152: S2.6 31.2,34.42 BATT.A 26.5,37.57 DM2.VDD
  Top 1: S2.3 S2.6
  Bottom 0.152: 37.5,40.1 DM3.VDD | 49.38,39.43 49.57,39.24
  Bottom 1: J6.+ 19.62,39.43 24.79,39.43 DM2.VDD 28.21,39.43 36.83,39.43 37.5,40.1 | DM3.VDD 37.5,40.03 38.1,39.43 47.62,39.43 48.5,40.31 | DM4.VDD 48.5,40.31 | 48.5,40.31 49.38,39.43 | 56.09,38.93 56.09,39.24 49.57,39.24 | 56.09,38.93 U$4.VDD U$5.VDD U$6.VDD U$8.VDD 56.09,6.2 | U$9.VDD 58,4.29 56.09,6.2 | 56.09,6.2 55.67,5.78 50.15,5.78 DM5.VDD 46.72,5.91 39.34,5.91 DM6.VDD 35.72,5.84 28.41,5.84 DM1.VDD | U$1.VDD 58,40.83 56.09,38.93
BNO_INT  (via drill 0.35)
  Top 0.152: U2.14 27.66,17.49 v27.94,17.21 | v15.88,13.02 U1.12
  GND 0.152: v15.88,13.02 17.02,14.16 28.19,14.16 29.02,14.99 29.02,16.19 28,17.21 v27.94,17.21
BNO_RESET  (via drill 0.35)
  Top 0.152: U2.11 R14.P$1 26.61,15.94 v27.94,15.94 | v14.61,13.02 U1.11
  GND 0.152: v14.61,13.02 17.53,15.94 v27.94,15.94
CUTOUT
  cutout Top: 69.53,16.7 64.14,16.7 64.14,44.26 69.53,44.26
  cutout GND: 64.14,16.57 64.14,44.32 69.53,44.32 69.53,16.64 64.2,16.64
  cutout +3V3: 64.14,16.57 64.14,44.26 69.47,44.26 69.47,16.64 64.2,16.64
  cutout Bottom: 64.14,16.57 69.53,16.57 69.53,44.32 64.07,44.32 64.07,16.64
GND  (via drill 0.35)
  Top 0.152: U3.15 37.15,17.72 | 37.15,17.72 U3.17 | U3.7 38.23,18.22 38.16,18.29 37.72,18.29 | 37.72,18.29 U3.17 | U3.6 37.65,17.72 | 37.65,17.72 U3.17 | U3.5 38.15,17.22 37.65,17.72 | U3.8 38.15,18.72 37.72,18.29 | U3.16 36.65,17.22 37.15,17.72 | C9.P$2 45.39,19.29 v45.4,19.3 | U5.GND 46.61,16.19 v46.29,15.88 | v48.64,15.3 48.64,13.96 U4.9 | v64.26,15.3 64.21,15.35 U8.0 | U8.66 65.51,15.92 v65.47,15.88 | U8.67 66.81,15.89 v66.8,15.88 | U8.68 68.11,15.98 v68.01,15.88 | 18.1,5.46 U6.29 17.97,5.59 16.97,6.59 U6.2 | U8.71 63.37,23.56 v62.23,23.56 | U8.70 63.34,21.65 v62.23,21.65 | U8.69 63.31,19.75 v62.23,19.75 | U8.58 61.09,25.4 v61.09,24.57 | U8.52 58.29,25.15 58.29,25.13 57.61,24.45 v57.21,24.45 | U8.55 60.21,27.26 v60.26,27.3 | U8.47 57.01,27.23 v57.21,27.43 | U8.43 55.41,26.82 v54.93,27.3 | U8.33 54.14,22.12 v53.34,22.92 | v53.34,17.21 54.5,17.21 U8.23 | U8.26 57.15,18.92 v57.21,18.99 | v63.5,27.37 64.21,26.66 U8.65 | J3.5_GND 66.23,9.02 67.82,7.43 v67.82,5.4
  other vias: 43.31,29.85 41.34,29.85 14.61,7.05 63.5,28.64 63.5,29.91 63.5,31.18 63.5,32.45 63.5,33.72 63.5,34.99 63.5,36.26 63.5,37.53 63.5,38.8 63.5,40.07 63.5,41.34 40.64,7.68 39.37,7.68 38.1,7.68 36.83,7.68 35.56,7.68 34.29,8.32 33.02,9.59 32.38,10.86 32.58,12.32 32.38,13.4 32.38,14.67 32.38,15.94 32.38,18.48 32.38,19.75 31.75,23.56 33.02,24.19 38.1,24.83 39.37,24.83 39.37,26.1 39.37,34.35 39.37,35.62 40.01,36.89 41.27,36.89 42.55,36.89 43.81,36.89 45.09,36.89 46.35,36.89 47.62,36.89 48.9,36.89 50.16,36.26 51.44,35.62 51.44,34.35 51.44,33.08 51.44,31.81 51.12,30.8 51.44,28.64 48.9,26.1 48.9,24.83 48.9,23.56 43.18,21.02 50.8,10.22 50.8,11.49 50.8,12.76 50.8,15.94 50.8,18.48 50.8,17.21 39.69,29.15 39.5,31.62
  pour Bottom: 0,0.06 0,43.62 69.41,43.62 69.41,0.06
  pour GND: 0,0.06 0,43.62 69.41,43.62 69.41,0.06
  pour Top: 40.45,27.37 45.28,27.37 45.28,30.29 44.01,30.29 44.01,32.13 40.45,32.13
  pour Top (rank 3): 0,0.06 0,43.62 69.53,43.62 69.53,0.06
GPIO_2  (via drill 0.35)
  Top 0.152: v17.65,25.46 U1.24
  Bottom 0.152: v17.65,25.46 17.65,29.15 19.05,30.54 19.05,36.89 18.41,37.53 11.43,37.53 10.03,36.13 J2.IO2
GPIO_4  (via drill 0.35)
  Top 0.152: v17.14,30.04 U1.26
  Bottom 0.152: J2.IO4 10.03,30.54 16.64,30.54 v17.14,30.04
GPIO_5
  Top 0.152: U1.29 13.34,31.24 13.84,31.75 13.84,33.91 12.57,35.18 J2.IO5
GPIO_12  (via drill 0.35)
  Top 0.152: U1.14 18.29,11.37 18.29,13.02 16,15.3 v16,22.73
  GND 0.152: J2.IO12 15.3,35.62 16.26,34.67 16.26,26.35 16,26.1 v16,22.73
GPIO_13  (via drill 0.35)
  Top 0.152: U1.16 17.85,15.29 16.83,16.32 16.83,24.89 v16.7,25.02
  GND 0.152: J2.IO13 18.29,32.45 18.29,27.81 16.7,26.23 v16.7,25.02
GPIO_14  (via drill 0.35)
  Top 0.152: U1.13 17.14,13.27 15.24,15.18 v15.24,23.56
  GND 0.152: J2.IO14 15.24,32.96 v15.24,23.56
GPIO_15  (via drill 0.35)
  Top 0.152: J2.IO15 19.05,34.23 19.05,30.23 21.91,27.37 21.91,24.26 v21.84,24.19 | v17.65,24.26 19.34,24.26 U1.23
  Bottom 0.152: v17.65,24.26 21.78,24.26 v21.84,24.19
GPIO_18
  Top 0.152: U1.30 12.06,32.58 J2.IO18
GPIO_19
  Top 0.152: U1.31 10.79,32.32 J2.IO19
GPIO_32  (via drill 0.35)
  Top 0.152: U1.8 10.79,13.78 12.64,15.62 12.64,21.59 11.3,22.92 v11.3,26.23
  GND 0.152: J2.IO32 11.3,26.73 v11.3,26.23
GPIO_33  (via drill 0.35)
  Top 0.152: U1.9 12.06,13.4 13.21,14.54 13.21,21.78 12.32,22.67 v12.32,26.23
  GND 0.152: J2.IO33 8.7,34.42 8.7,31.56 12.32,27.94 v12.32,26.23
GPIO_34  (via drill 0.35)
  Top 0.152: U1.6 8.19,11.3 8.19,13.4 2.48,19.11 2.48,22.86 v2.54,22.92
  Bottom 0.152: v2.54,22.92 2.41,23.05 J2.IO34
N$1
  Top 0.152: U1.3 R2.P$1 5.7,9.21 C1.P$2
N$2
  Top 0.152: R6.P$2 22.3,30.26 3.3V.C
N$3
  Top 0.152: U3.9 38.15,20.69 C10.P$1
N$4  (via drill 0.35)
  Top 0.152: v17.78,9.14 18.1,8.83 U6.25 | v6.99,26.35 6.99,28 U1.34 6.99,30.16 R1.P$1
  Bottom 0.152: v6.99,26.35 7.05,26.35 8.95,24.45 8.95,15.81 15.62,9.14 v17.78,9.14
N$5  (via drill 0.35)
  Top 0.152: v18.92,9.14 18.54,8.76 18.54,8.02 U6.24 | U1.35 v5.71,26.42
  Bottom 0.152: v5.71,26.42 8.32,23.81 8.32,15.43 15.62,8.13 18.35,8.13 18.92,8.7 v18.92,9.14
N$6
  Top 0.152: PROG.B1 PROG.B2 22.3,12.06 20.95,13.4 20.95,26.73 19.45,28.24 U1.25
N$7
  Top 0.152: 37.65,13.97 L1.2
  Top 0.3: U3.1 U3.2 U3.3 37.65,13.97
N$8  (via drill 0.35)
  Top 0.152: U5.OE 48.59,17.72 48.58,17.72 48.07,18.22 U5.!OE 46.61,18.92 v47.05,19.37 | U4.16 43.46,13.95 v43.12,14.29
  Bottom 0.152: v47.05,19.37 47.05,17.97 43.37,14.29 v43.12,14.29
N$9
  Top 0.152: U3.4 38.16,16.48 38.16,15.68 38.67,15.18 40.39,15.18 R4.P$1
N$10
  Top 0.152: U4.14 45.38,14.84 45.72,15.18 47.37,15.18 48.13,15.94 48.13,16.64 48.72,17.22 U5.Y1
N$11
  Top 0.152: U5.A2 49.31,13.24 48.45,12.38 46.29,12.38 46.03,12.64 U4.13
N$12  (via drill 0.35)
  Top 0.152: J3.2_SWDIO 63.44,10.8 60.2,10.8 59.5,11.49 v59.5,14.54 | U8.1 63.41,15.91 v63.37,15.88
  Bottom 0.152: v63.37,15.88 v63.37,15.87 60.21,15.87 59.57,15.23 59.57,14.54 v59.5,14.54
N$13
  Top 0.152: C14.P$1 36.64,21.78 | 36.64,19.46 U3.12
  Top 0.3: U3.11 U3.10 37.65,20.77 37.15,21.27 | U3.11 U3.12 36.02,19.45 35.93,19.35 U3.13 | 36.64,19.46 36.64,21.78 37.15,21.27 | U3.11 37.15,21.27
  Top 0.9: 35.37,30.42 35.37,23.05 C14.P$1
  Top 1: 35.37,30.42 S2.5 S2.2
N$14
  Top 0.152: U4.8 48.63,6.72 R3.P$1
N$15
  Top 0.152: R7.P$2 29.1,30.26 BATT.C
N$16  (via drill 0.35)
  Top 0.152: J1.VCC 8.53,6.52 v7.94,7.11 | U6.8 16.6,1.67 v16.57,1.65
  Bottom 0.152: v16.57,1.65 11.43,1.65 7.94,5.14 v7.94,7.11
N$17
  Top 0.152: U6.3 14.61,6.09 13.72,6.98 10.22,6.98 9.83,6.59 J1.D+
N$18  (via drill 0.35)
  Top 0.152: J1.D- 9.14,5.61 v9.14,6.98 | U6.4 14.67,5.59 v14.54,5.46
  Bottom 0.152: v9.14,6.98 10.67,5.46 v14.54,5.46
N$19  (via drill 0.35)
  Top 0.152: R5.P$1 46.59,17.21 U5.Y2 | U5.Y2 U5.A1 | U5.Y2 47.58,17.22 v47.82,17.46
  GND 0.152: v47.82,17.46 50.83,14.45 50.83,14.42 51.27,13.97 57.53,13.97 58.09,13.41 U$6.DATA
  Bottom 0.152: DM2.DATA 30.21,42.36 38.73,42.36 40,41.1 DM3.DATA 41.28,42.37 49.72,42.37 DM4.DATA 51,41.31 52.07,42.38 58.96,42.38 U$1.DATA 60,37.53 U$4.DATA U$5.DATA U$6.DATA U$8.DATA 58.09,6.1 60,4.19 U$9.DATA 58.79,2.03 52.01,2.03 51,3.04 | 51,3.04 DM5.DATA | DM6.DATA 40.1,3.97 | 40.1,3.97 42.1,1.97 49.93,1.97 51,3.04 | DM1.DATA 30.97,1.97 38.1,1.97 40.1,3.97
N$20
  Top 0.152: J3.4_SWDCLK 64.01,11.49 64.01,14.1 62.67,15.43 62.67,17.11 U8.3
N$21  (via drill 0.35)
  Top 0.152: J3.3_NRESET 64.01,8.32 64.01,5.33 v63.12,4.44 | U8.19 56.33,17.06 56.33,16.13 57.21,15.24 61.28,15.24 v61.4,15.11
  Bottom 0.152: v61.4,15.11 61.4,14.65 59.75,13 59.75,6.79 62.1,4.44 v63.12,4.44
N$23
  Top 0.152: R19.P$2 25.6,30.13 5V.C
N$71
  Top 0.152: R11.P$1 U2.4
N$72
  Top 0.152: C6.P$2 25.15,18.49 U2.9
N$77
  Top 0.152: U7.6 47.26,28.96 R15.P$1 50.15,28.96 R16.P$2
N$78
  Top 0.152: 45.66,30.88 L3.1
  Top 0.3: U7.9 45.66,30.88
N$80
  Top 0.152: U7.4 46.66,23.19 R17.P$1
N$81
  Top 0.152: U7.2 45.66,23.23 R18.P$1
SCL  (via drill 0.35)
  Top 0.152: U2.19 27.17,20.82 v27.05,20.7 | v10.22,24.76 6.1,24.76 4.45,26.42 U1.36 | U8.38 56.86,23.72 v57.15,23.43 | R8.P$1 51.31,21.21 v51.12,21.02
  GND 0.152: v57.15,23.43 57.85,22.73 57.85,21.27 56.99,20.41 51.44,20.41 | v27.05,20.7 42.64,20.7 42.93,20.41 51.44,20.41 | v51.12,21.02 51.12,20.73 51.44,20.41
  Bottom 0.152: J2.SCL 2.41,34.81 3.34,33.88 3.34,30.12 5.59,27.88 7.11,27.88 v10.22,24.76 15.88,19.11 25.4,19.11 26.99,20.7 v27.05,20.7
SDA  (via drill 0.35)
  Top 0.152: U2.20 28.16,22.26 v27.75,22.67 | v10.22,26.23 8.64,26.23 8.26,26.61 U1.33 | U8.36 56.52,22.92 v57.15,22.29 | R9.P$1 v52.39,22.99
  GND 0.152: v57.15,22.29 52.29,22.29 | 52.29,22.29 51.69,21.68 28.74,21.68 v27.75,22.67 | v52.39,22.99 52.39,22.38 52.29,22.29
  Bottom 0.152: J2.SDA 4.83,35.5 6.29,34.04 6.29,30.16 v10.22,26.23 15.43,21.02 24.16,21.02 24.39,21.24 26.32,21.24 v27.75,22.67
SERVO_DIR  (via drill 0.35)
  Top 0.152: U4.1 43.09,8.41 v42.55,8.95 | U1.37 3.17,24.38 5.33,22.23 v10.16,22.23
  Bottom 0.152: v10.16,22.23 12,20.38 12,14.76 15.91,10.86 21.91,10.86 23.81,8.95 v42.55,8.95
SERVO_RX  (via drill 0.35)
  Top 0.152: U4.3 45.38,9.29 44.45,10.22 v42.55,10.22 | U1.27 15.88,27.18 14.54,25.84 14.54,15.62 14.48,15.56 v14.48,14.73
  Bottom 0.152: v14.48,14.73 19.75,14.73 24.26,10.22 v42.55,10.22
SERVO_TX  (via drill 0.35)
  Top 0.152: U4.4 46.03,10.55 45.09,11.49 v42.55,11.49 | U1.28 14.61,27.37 13.84,26.61 v13.84,16.38
  Bottom 0.152: v13.84,16.38 20.07,16.38 24.96,11.49 v42.55,11.49
SKILL_INT
  Top 0.152: U1.7 9.53,9.78 31.75,9.78 34.61,6.92 40.96,6.92 42.42,5.46 50.67,5.46 52.7,7.49 52.7,14.47 U8.21

### Text on the board
tPlace: AX-12A: 12V / XL-320: 7.4V